# Altium project copper_suicide.PrjPCB (part 1 of 5)
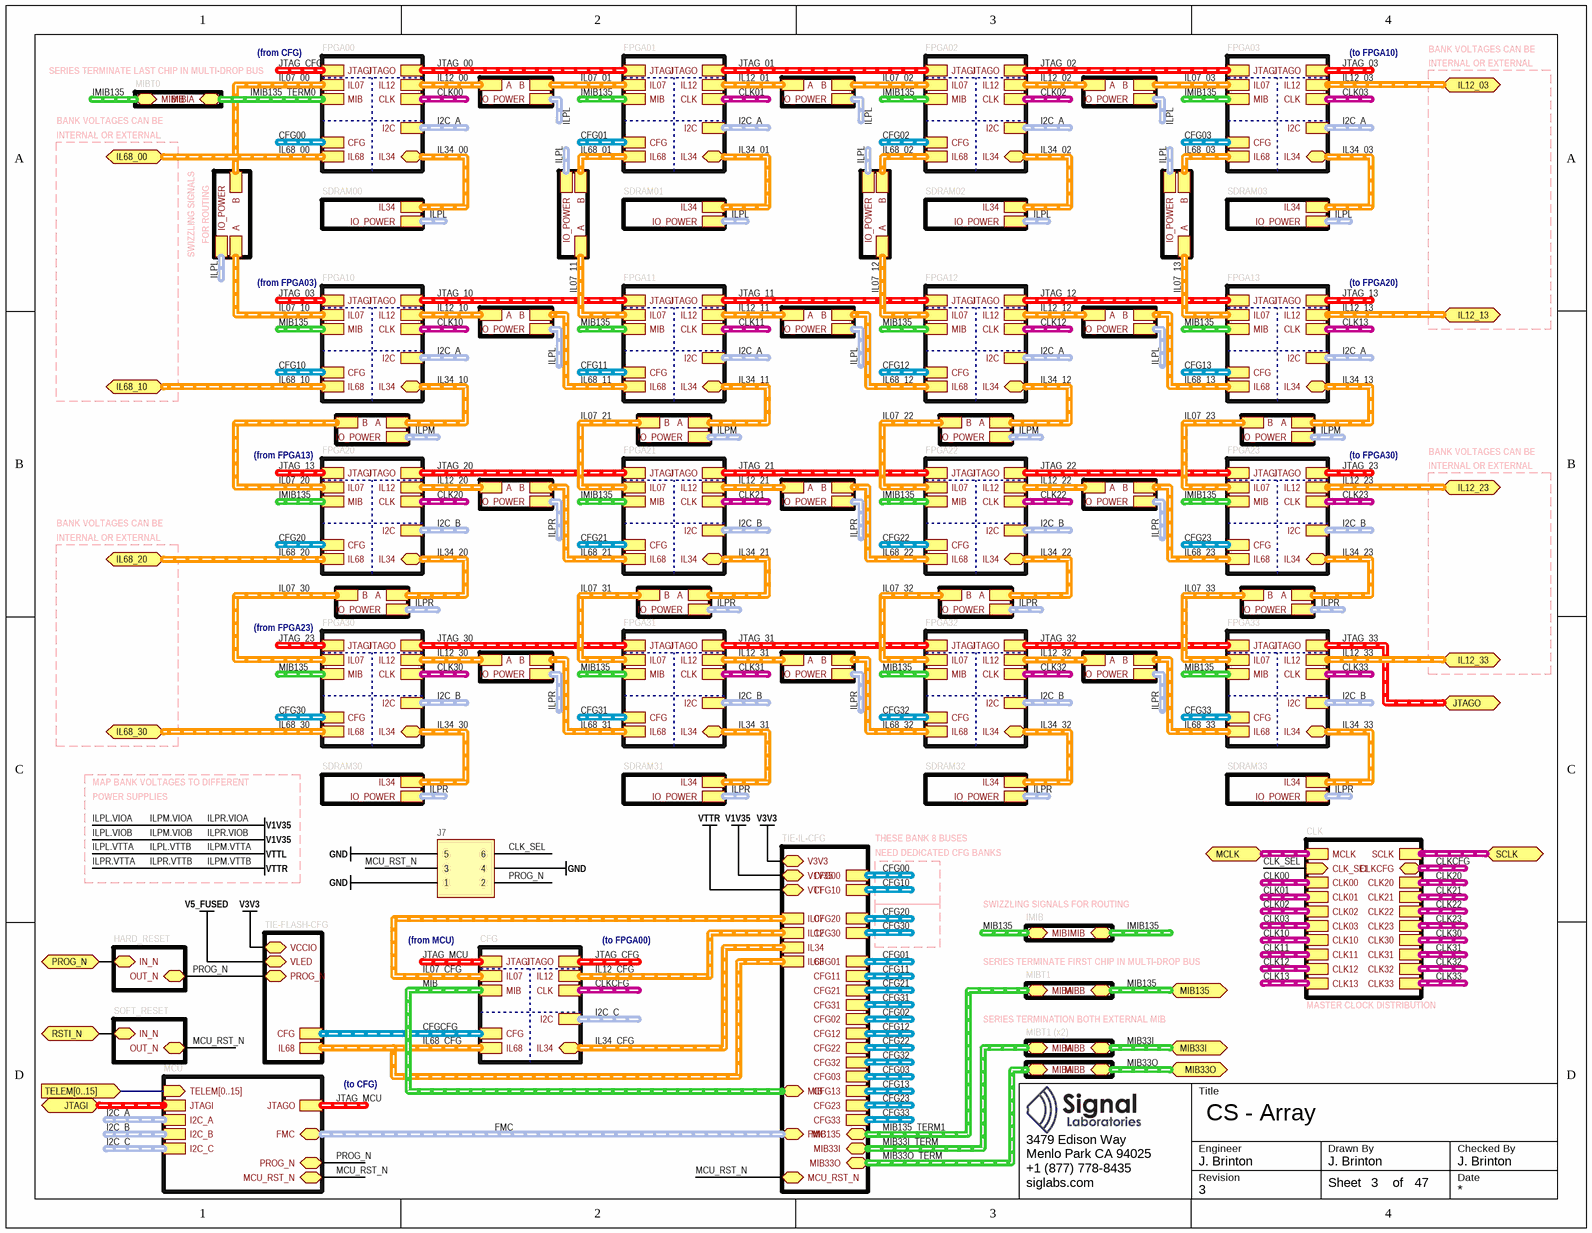
[diagram p0: array.SchDoc]
22 sheets, 1810 parts. Net scope: hierarchical (ports join the sheet entries above them; power ports are global).
Board file: copper_suicide.PcbDoc
Sheets:
  array.SchDoc
    FPGA01 = fpga.SchDoc
      FPGA0B = fpga-bank0.SchDoc
      FPGA1B = fpga-bank1.SchDoc
      FPGA2B = fpga-bank2.SchDoc
      FPGA3B = fpga-bank3.SchDoc
      FPGA4B = fpga-bank4.SchDoc
      FPGA6B = fpga-bank6.SchDoc
      FPGA7B = fpga-bank7.SchDoc
      FPGA8B = fpga-bank8.SchDoc
      FPGAGND = fpga-ground.SchDoc
      FPGAMISC = fpga-misc.SchDoc
      FPGASERDES = fpga-serdes.SchDoc
      FPGAPOWER = fpga-power.SchDoc
    FPGA02 = fpga.SchDoc
      FPGA0B = fpga-bank0.SchDoc
      FPGA1B = fpga-bank1.SchDoc
      FPGA2B = fpga-bank2.SchDoc
      FPGA3B = fpga-bank3.SchDoc
      FPGA4B = fpga-bank4.SchDoc
      FPGA6B = fpga-bank6.SchDoc
      FPGA7B = fpga-bank7.SchDoc
      FPGA8B = fpga-bank8.SchDoc
      FPGAGND = fpga-ground.SchDoc
      FPGAMISC = fpga-misc.SchDoc
      FPGASERDES = fpga-serdes.SchDoc
      FPGAPOWER = fpga-power.SchDoc
    FPGA03 = fpga.SchDoc
      FPGA0B = fpga-bank0.SchDoc
      FPGA1B = fpga-bank1.SchDoc
      FPGA2B = fpga-bank2.SchDoc
      FPGA3B = fpga-bank3.SchDoc
      FPGA4B = fpga-bank4.SchDoc
      FPGA6B = fpga-bank6.SchDoc
      FPGA7B = fpga-bank7.SchDoc
      FPGA8B = fpga-bank8.SchDoc
      FPGAGND = fpga-ground.SchDoc
      FPGAMISC = fpga-misc.SchDoc
      FPGASERDES = fpga-serdes.SchDoc
      FPGAPOWER = fpga-power.SchDoc
    FPGA30 = fpga.SchDoc
      FPGA0B = fpga-bank0.SchDoc
      FPGA1B = fpga-bank1.SchDoc
      FPGA2B = fpga-bank2.SchDoc
      FPGA3B = fpga-bank3.SchDoc
      FPGA4B = fpga-bank4.SchDoc
      FPGA6B = fpga-bank6.SchDoc
      FPGA7B = fpga-bank7.SchDoc
      FPGA8B = fpga-bank8.SchDoc
      FPGAGND = fpga-ground.SchDoc
      FPGAMISC = fpga-misc.SchDoc
      FPGASERDES = fpga-serdes.SchDoc
      FPGAPOWER = fpga-power.SchDoc
    FPGA31 = fpga.SchDoc
      FPGA0B = fpga-bank0.SchDoc
      FPGA1B = fpga-bank1.SchDoc
      FPGA2B = fpga-bank2.SchDoc
      FPGA3B = fpga-bank3.SchDoc
      FPGA4B = fpga-bank4.SchDoc
      FPGA6B = fpga-bank6.SchDoc
      FPGA7B = fpga-bank7.SchDoc
      FPGA8B = fpga-bank8.SchDoc
      FPGAGND = fpga-ground.SchDoc
      FPGAMISC = fpga-misc.SchDoc
      FPGASERDES = fpga-serdes.SchDoc
      FPGAPOWER = fpga-power.SchDoc
    FPGA32 = fpga.SchDoc
      FPGA0B = fpga-bank0.SchDoc
      FPGA1B = fpga-bank1.SchDoc
      FPGA2B = fpga-bank2.SchDoc
      FPGA3B = fpga-bank3.SchDoc
      FPGA4B = fpga-bank4.SchDoc
      FPGA6B = fpga-bank6.SchDoc
      FPGA7B = fpga-bank7.SchDoc
      FPGA8B = fpga-bank8.SchDoc
      FPGAGND = fpga-ground.SchDoc
      FPGAMISC = fpga-misc.SchDoc
      FPGASERDES = fpga-serdes.SchDoc
      FPGAPOWER = fpga-power.SchDoc
    FPGA33 = fpga.SchDoc
      FPGA0B = fpga-bank0.SchDoc
      FPGA1B = fpga-bank1.SchDoc
      FPGA2B = fpga-bank2.SchDoc
      FPGA3B = fpga-bank3.SchDoc
      FPGA4B = fpga-bank4.SchDoc
      FPGA6B = fpga-bank6.SchDoc
      FPGA7B = fpga-bank7.SchDoc
      FPGA8B = fpga-bank8.SchDoc
      FPGAGND = fpga-ground.SchDoc
      FPGAMISC = fpga-misc.SchDoc
      FPGASERDES = fpga-serdes.SchDoc
      FPGAPOWER = fpga-power.SchDoc
    FPGA10 = fpga.SchDoc
      FPGA0B = fpga-bank0.SchDoc
      FPGA1B = fpga-bank1.SchDoc
      FPGA2B = fpga-bank2.SchDoc
      FPGA3B = fpga-bank3.SchDoc
      FPGA4B = fpga-bank4.SchDoc
      FPGA6B = fpga-bank6.SchDoc
      FPGA7B = fpga-bank7.SchDoc
      FPGA8B = fpga-bank8.SchDoc
      FPGAGND = fpga-ground.SchDoc
      FPGAMISC = fpga-misc.SchDoc
      FPGASERDES = fpga-serdes.SchDoc
      FPGAPOWER = fpga-power.SchDoc
    FPGA11 = fpga.SchDoc
      FPGA0B = fpga-bank0.SchDoc
      FPGA1B = fpga-bank1.SchDoc
      FPGA2B = fpga-bank2.SchDoc
      FPGA3B = fpga-bank3.SchDoc
      FPGA4B = fpga-bank4.SchDoc
      FPGA6B = fpga-bank6.SchDoc
      FPGA7B = fpga-bank7.SchDoc
      FPGA8B = fpga-bank8.SchDoc
      FPGAGND = fpga-ground.SchDoc
      FPGAMISC = fpga-misc.SchDoc
      FPGASERDES = fpga-serdes.SchDoc
      FPGAPOWER = fpga-power.SchDoc
    FPGA12 = fpga.SchDoc
      FPGA0B = fpga-bank0.SchDoc
      FPGA1B = fpga-bank1.SchDoc
      FPGA2B = fpga-bank2.SchDoc
      FPGA3B = fpga-bank3.SchDoc
      FPGA4B = fpga-bank4.SchDoc
      FPGA6B = fpga-bank6.SchDoc
      FPGA7B = fpga-bank7.SchDoc
      FPGA8B = fpga-bank8.SchDoc
      FPGAGND = fpga-ground.SchDoc
      FPGAMISC = fpga-misc.SchDoc
      FPGASERDES = fpga-serdes.SchDoc
      FPGAPOWER = fpga-power.SchDoc
    FPGA13 = fpga.SchDoc
      FPGA0B = fpga-bank0.SchDoc
      FPGA1B = fpga-bank1.SchDoc
      FPGA2B = fpga-bank2.SchDoc
      FPGA3B = fpga-bank3.SchDoc
      FPGA4B = fpga-bank4.SchDoc
      FPGA6B = fpga-bank6.SchDoc
      FPGA7B = fpga-bank7.SchDoc
      FPGA8B = fpga-bank8.SchDoc
      FPGAGND = fpga-ground.SchDoc
      FPGAMISC = fpga-misc.SchDoc
      FPGASERDES = fpga-serdes.SchDoc
      FPGAPOWER = fpga-power.SchDoc
    FPGA20 = fpga.SchDoc
      FPGA0B = fpga-bank0.SchDoc
      FPGA1B = fpga-bank1.SchDoc
      FPGA2B = fpga-bank2.SchDoc
      FPGA3B = fpga-bank3.SchDoc
      FPGA4B = fpga-bank4.SchDoc
      FPGA6B = fpga-bank6.SchDoc
      FPGA7B = fpga-bank7.SchDoc
      FPGA8B = fpga-bank8.SchDoc
      FPGAGND = fpga-ground.SchDoc
      FPGAMISC = fpga-misc.SchDoc
      FPGASERDES = fpga-serdes.SchDoc
      FPGAPOWER = fpga-power.SchDoc
    FPGA21 = fpga.SchDoc
      FPGA0B = fpga-bank0.SchDoc
      FPGA1B = fpga-bank1.SchDoc
      FPGA2B = fpga-bank2.SchDoc
      FPGA3B = fpga-bank3.SchDoc
      FPGA4B = fpga-bank4.SchDoc
      FPGA6B = fpga-bank6.SchDoc
      FPGA7B = fpga-bank7.SchDoc
      FPGA8B = fpga-bank8.SchDoc
      FPGAGND = fpga-ground.SchDoc
      FPGAMISC = fpga-misc.SchDoc
      FPGASERDES = fpga-serdes.SchDoc
      FPGAPOWER = fpga-power.SchDoc
    FPGA22 = fpga.SchDoc
      FPGA0B = fpga-bank0.SchDoc
      FPGA1B = fpga-bank1.SchDoc
      FPGA2B = fpga-bank2.SchDoc
      FPGA3B = fpga-bank3.SchDoc
      FPGA4B = fpga-bank4.SchDoc
      FPGA6B = fpga-bank6.SchDoc
      FPGA7B = fpga-bank7.SchDoc
      FPGA8B = fpga-bank8.SchDoc
      FPGAGND = fpga-ground.SchDoc
      FPGAMISC = fpga-misc.SchDoc
      FPGASERDES = fpga-serdes.SchDoc
      FPGAPOWER = fpga-power.SchDoc
    FPGA23 = fpga.SchDoc
      FPGA0B = fpga-bank0.SchDoc
      FPGA1B = fpga-bank1.SchDoc
      FPGA2B = fpga-bank2.SchDoc
      FPGA3B = fpga-bank3.SchDoc
      FPGA4B = fpga-bank4.SchDoc
      FPGA6B = fpga-bank6.SchDoc
      FPGA7B = fpga-bank7.SchDoc
      FPGA8B = fpga-bank8.SchDoc
      FPGAGND = fpga-ground.SchDoc
      FPGAMISC = fpga-misc.SchDoc
      FPGASERDES = fpga-serdes.SchDoc
      FPGAPOWER = fpga-power.SchDoc
    CLK = clock.SchDoc
    CFG = fpga.SchDoc
      FPGA0B = fpga-bank0.SchDoc
      FPGA1B = fpga-bank1.SchDoc
      FPGA2B = fpga-bank2.SchDoc
      FPGA3B = fpga-bank3.SchDoc
      FPGA4B = fpga-bank4.SchDoc
      FPGA6B = fpga-bank6.SchDoc
      FPGA7B = fpga-bank7.SchDoc
      FPGA8B = fpga-bank8.SchDoc
      FPGAGND = fpga-ground.SchDoc
      FPGAMISC = fpga-misc.SchDoc
      FPGASERDES = fpga-serdes.SchDoc
      FPGAPOWER = fpga-power.SchDoc
    FPGA00 = fpga.SchDoc
      FPGA0B = fpga-bank0.SchDoc
      FPGA1B = fpga-bank1.SchDoc
      FPGA2B = fpga-bank2.SchDoc
      FPGA3B = fpga-bank3.SchDoc
      FPGA4B = fpga-bank4.SchDoc
      FPGA6B = fpga-bank6.SchDoc
      FPGA7B = fpga-bank7.SchDoc
      FPGA8B = fpga-bank8.SchDoc
      FPGAGND = fpga-ground.SchDoc
      FPGAMISC = fpga-misc.SchDoc
      FPGASERDES = fpga-serdes.SchDoc
      FPGAPOWER = fpga-power.SchDoc
  con-right-bot.SchDoc
  con-left-bot.SchDoc
  con-right-top.SchDoc
  con-left-top.SchDoc
  config.SchDoc
  flash.SchDoc
  fans.SchDoc

## Sheet array.SchDoc: CS - Array
size Letter; CheckedBy: J. Brinton; CompanyName: Signal Laboratories, Inc.; DrawnBy: J. Brinton; Engineer: J. Brinton; Address1: 3479 Edison Way; Address2: Menlo Park CA 94025; Address3: +1 (877) 778-8435; Address4: siglabs.com; Revision: 3; SheetNumber: 3; SheetTotal: 47

### Parts
J7  GRPB032MWCN-RC  [GRPB032MWCN]  (value not drawn)

### Sub-sheets
CFG = fpga.SchDoc: MIB (harness MIB), CFG (harness CFG), JTAGI (harness JTAG-3V3), JTAGO (harness JTAG-3V3), IL07 (harness IL), IL68 (harness IL), IL12 (harness IL), CLK (harness LVPECL33), IL34 (harness IL), I2C (harness I2C-3V3)
CLK = clock.SchDoc: MCLK (harness LVPECL33), SCLK (harness LVPECL33), CLK00 (harness LVPECL33), CLK01 (harness LVPECL33), CLK02 (harness LVPECL33), CLK03 (harness LVPECL33), CLK10 (harness LVPECL33), CLK11 (harness LVPECL33), CLK12 (harness LVPECL33), CLK13 (harness LVPECL33), CLK20 (harness LVPECL33), CLK21 (harness LVPECL33), CLK22 (harness LVPECL33), CLK23 (harness LVPECL33), CLK30 (harness LVPECL33), CLK31 (harness LVPECL33), CLK32 (harness LVPECL33), CLK33 (harness LVPECL33), CLKCFG (harness LVPECL33), CLK_SEL (in)
FPGA00 = fpga.SchDoc: MIB (harness MIB), CFG (harness CFG), JTAGI (harness JTAG-3V3), JTAGO (harness JTAG-3V3), IL07 (harness IL), IL68 (harness IL), IL12 (harness IL), CLK (harness LVPECL33), IL34 (harness IL), I2C (harness I2C-3V3)
FPGA01 = fpga.SchDoc: MIB (harness MIB), CFG (harness CFG), JTAGI (harness JTAG-3V3), JTAGO (harness JTAG-3V3), IL07 (harness IL), IL68 (harness IL), IL12 (harness IL), CLK (harness LVPECL33), IL34 (harness IL), I2C (harness I2C-3V3)
FPGA02 = fpga.SchDoc: MIB (harness MIB), CFG (harness CFG), JTAGI (harness JTAG-3V3), JTAGO (harness JTAG-3V3), IL07 (harness IL), IL68 (harness IL), IL12 (harness IL), CLK (harness LVPECL33), IL34 (harness IL), I2C (harness I2C-3V3)
FPGA03 = fpga.SchDoc: MIB (harness MIB), CFG (harness CFG), JTAGI (harness JTAG-3V3), JTAGO (harness JTAG-3V3), IL07 (harness IL), IL68 (harness IL), IL12 (harness IL), CLK (harness LVPECL33), IL34 (harness IL), I2C (harness I2C-3V3)
FPGA10 = fpga.SchDoc: MIB (harness MIB), CFG (harness CFG), JTAGI (harness JTAG-3V3), JTAGO (harness JTAG-3V3), IL07 (harness IL), IL68 (harness IL), IL12 (harness IL), CLK (harness LVPECL33), IL34 (harness IL), I2C (harness I2C-3V3)
FPGA11 = fpga.SchDoc: MIB (harness MIB), CFG (harness CFG), JTAGI (harness JTAG-3V3), JTAGO (harness JTAG-3V3), IL07 (harness IL), IL68 (harness IL), IL12 (harness IL), CLK (harness LVPECL33), IL34 (harness IL), I2C (harness I2C-3V3)
FPGA12 = fpga.SchDoc: MIB (harness MIB), CFG (harness CFG), JTAGI (harness JTAG-3V3), JTAGO (harness JTAG-3V3), IL07 (harness IL), IL68 (harness IL), IL12 (harness IL), CLK (harness LVPECL33), IL34 (harness IL), I2C (harness I2C-3V3)
FPGA13 = fpga.SchDoc: MIB (harness MIB), CFG (harness CFG), JTAGI (harness JTAG-3V3), JTAGO (harness JTAG-3V3), IL07 (harness IL), IL68 (harness IL), IL12 (harness IL), CLK (harness LVPECL33), IL34 (harness IL), I2C (harness I2C-3V3)
FPGA20 = fpga.SchDoc: MIB (harness MIB), CFG (harness CFG), JTAGI (harness JTAG-3V3), JTAGO (harness JTAG-3V3), IL07 (harness IL), IL68 (harness IL), IL12 (harness IL), CLK (harness LVPECL33), IL34 (harness IL), I2C (harness I2C-3V3)
FPGA21 = fpga.SchDoc: MIB (harness MIB), CFG (harness CFG), JTAGI (harness JTAG-3V3), JTAGO (harness JTAG-3V3), IL07 (harness IL), IL68 (harness IL), IL12 (harness IL), CLK (harness LVPECL33), IL34 (harness IL), I2C (harness I2C-3V3)
FPGA22 = fpga.SchDoc: MIB (harness MIB), CFG (harness CFG), JTAGI (harness JTAG-3V3), JTAGO (harness JTAG-3V3), IL07 (harness IL), IL68 (harness IL), IL12 (harness IL), CLK (harness LVPECL33), IL34 (harness IL), I2C (harness I2C-3V3)
FPGA23 = fpga.SchDoc: MIB (harness MIB), CFG (harness CFG), JTAGI (harness JTAG-3V3), JTAGO (harness JTAG-3V3), IL07 (harness IL), IL68 (harness IL), IL12 (harness IL), CLK (harness LVPECL33), IL34 (harness IL), I2C (harness I2C-3V3)
FPGA30 = fpga.SchDoc: MIB (harness MIB), CFG (harness CFG), JTAGI (harness JTAG-3V3), JTAGO (harness JTAG-3V3), IL07 (harness IL), IL68 (harness IL), IL12 (harness IL), CLK (harness LVPECL33), IL34 (harness IL), I2C (harness I2C-3V3)
FPGA31 = fpga.SchDoc: MIB (harness MIB), CFG (harness CFG), JTAGI (harness JTAG-3V3), JTAGO (harness JTAG-3V3), IL07 (harness IL), IL68 (harness IL), IL12 (harness IL), CLK (harness LVPECL33), IL34 (harness IL), I2C (harness I2C-3V3)
FPGA32 = fpga.SchDoc: MIB (harness MIB), CFG (harness CFG), JTAGI (harness JTAG-3V3), JTAGO (harness JTAG-3V3), IL07 (harness IL), IL68 (harness IL), IL12 (harness IL), CLK (harness LVPECL33), IL34 (harness IL), I2C (harness I2C-3V3)
FPGA33 = fpga.SchDoc: MIB (harness MIB), CFG (harness CFG), JTAGI (harness JTAG-3V3), JTAGO (harness JTAG-3V3), IL07 (harness IL), IL68 (harness IL), IL12 (harness IL), CLK (harness LVPECL33), IL34 (harness IL), I2C (harness I2C-3V3)
HARD_RESET = reset.SchDoc (file not in this document): OUT_N (bidir), IN_N (bidir)
IMIB = tie-mib-imib.SchDoc (file not in this document): MIB (harness MIB), IMIB (harness MIB)
MCU = MCU.SchDoc (file not in this document): JTAGI (harness JTAG-3V3), JTAGO (harness JTAG-3V3), I2C_A (harness I2C-3V3), I2C_B (harness I2C-3V3), I2C_C (harness I2C-3V3), TELEM[0..15] (in), FMC (harness FMC-3V3), PROG_N (bidir), MCU_RST_N (bidir)
MIBIT1 = tie-mib-term1.SchDoc (file not in this document): MIBB (harness MIB), MIBA (harness MIB)
MIBOT1 = tie-mib-term1.SchDoc (file not in this document): MIBB (harness MIB), MIBA (harness MIB)
MIBT0 = tie-mib-term0.SchDoc (file not in this document): MIBIB (harness MIB), MIBIA (harness MIB)
MIBT1 = tie-mib-term1.SchDoc (file not in this document): MIBB (harness MIB), MIBA (harness MIB)
SDRAM00 = tie-il34-sdram.SchDoc (file not in this document): IL34 (harness IL), IO_POWER (harness ILP)
SDRAM01 = tie-il34-sdram.SchDoc (file not in this document): IL34 (harness IL), IO_POWER (harness ILP)
SDRAM02 = tie-il34-sdram.SchDoc (file not in this document): IL34 (harness IL), IO_POWER (harness ILP)
SDRAM03 = tie-il34-sdram.SchDoc (file not in this document): IL34 (harness IL), IO_POWER (harness ILP)
SDRAM30 = tie-il34-sdram.SchDoc (file not in this document): IL34 (harness IL), IO_POWER (harness ILP)
SDRAM31 = tie-il34-sdram.SchDoc (file not in this document): IL34 (harness IL), IO_POWER (harness ILP)
SDRAM32 = tie-il34-sdram.SchDoc (file not in this document): IL34 (harness IL), IO_POWER (harness ILP)
SDRAM33 = tie-il34-sdram.SchDoc (file not in this document): IL34 (harness IL), IO_POWER (harness ILP)
SOFT_RESET = reset.SchDoc (file not in this document): OUT_N (bidir), IN_N (bidir)
TIE-FLASH-CFG = tie-flash-cfg.SchDoc (file not in this document): CFG (harness CFG), PROG_N (bidir), VCCIO, IL68 (harness IL), VLED
TIE-IL07_00-IL07_10 = tie-il07-il07.SchDoc (file not in this document): B (harness IL), A (harness IL), IO_POWER (harness ILP)
TIE-IL12_00-IL07_01 = tie-il12-il07.SchDoc (file not in this document): A (harness IL), B (harness IL), IO_POWER (harness ILP)
TIE-IL12_01-IL07_02 = tie-il12-il07.SchDoc (file not in this document): A (harness IL), B (harness IL), IO_POWER (harness ILP)
TIE-IL12_02-IL07_03 = tie-il12-il07.SchDoc (file not in this document): A (harness IL), B (harness IL), IO_POWER (harness ILP)
TIE-IL12_10-IL68_11 = tie-il12-il68.SchDoc (file not in this document): A (harness IL), B (harness IL), IO_POWER (harness ILP)
TIE-IL12_11-IL68_12 = tie-il12-il68.SchDoc (file not in this document): A (harness IL), B (harness IL), IO_POWER (harness ILP)
TIE-IL12_12-IL68_13 = tie-il12-il68.SchDoc (file not in this document): A (harness IL), B (harness IL), IO_POWER (harness ILP)
TIE-IL12_20-IL68_21 = tie-il12-il68.SchDoc (file not in this document): A (harness IL), B (harness IL), IO_POWER (harness ILP)
TIE-IL12_21-IL68_22 = tie-il12-il68.SchDoc (file not in this document): A (harness IL), B (harness IL), IO_POWER (harness ILP)
TIE-IL12_22-IL68_23 = tie-il12-il68.SchDoc (file not in this document): A (harness IL), B (harness IL), IO_POWER (harness ILP)
TIE-IL12_30-IL68_31 = tie-il12-il68.SchDoc (file not in this document): A (harness IL), B (harness IL), IO_POWER (harness ILP)
TIE-IL12_31-IL68_32 = tie-il12-il68.SchDoc (file not in this document): A (harness IL), B (harness IL), IO_POWER (harness ILP)
TIE-IL12_32-IL68_33 = tie-il12-il68.SchDoc (file not in this document): A (harness IL), B (harness IL), IO_POWER (harness ILP)
TIE-IL34_10-IL07_20 = tie-il34-il07.SchDoc (file not in this document): B (harness IL), A (harness IL), IO_POWER (harness ILP)
TIE-IL34_11-IL07_21 = tie-il34-il07.SchDoc (file not in this document): B (harness IL), A (harness IL), IO_POWER (harness ILP)
TIE-IL34_12-IL07_22 = tie-il34-il07.SchDoc (file not in this document): B (harness IL), A (harness IL), IO_POWER (harness ILP)
TIE-IL34_13-IL07_23 = tie-il34-il07.SchDoc (file not in this document): B (harness IL), A (harness IL), IO_POWER (harness ILP)
TIE-IL34_20-IL07_30 = tie-il34-il07.SchDoc (file not in this document): B (harness IL), A (harness IL), IO_POWER (harness ILP)
TIE-IL34_21-IL07_31 = tie-il34-il07.SchDoc (file not in this document): B (harness IL), A (harness IL), IO_POWER (harness ILP)
TIE-IL34_22-IL07_32 = tie-il34-il07.SchDoc (file not in this document): B (harness IL), A (harness IL), IO_POWER (harness ILP)
TIE-IL34_23-IL07_33 = tie-il34-il07.SchDoc (file not in this document): B (harness IL), A (harness IL), IO_POWER (harness ILP)
TIE-IL68_00-IL07_01 = tie-il68-il07.SchDoc (file not in this document): B (harness IL), A (harness IL), IO_POWER (harness ILP)
TIE-IL68_00-IL07_01 = tie-il68-il07.SchDoc (file not in this document): B (harness IL), A (harness IL), IO_POWER (harness ILP)
TIE-IL68_00-IL07_01 = tie-il68-il07.SchDoc (file not in this document): B (harness IL), A (harness IL), IO_POWER (harness ILP)
TIE-IL-CFG = tie-il-cfg.SchDoc (file not in this document): CFG03 (harness CFG), CFG02 (harness CFG), CFG01 (harness CFG), CFG00 (harness CFG), MIB33O (harness MIB), CFG13 (harness CFG), CFG12 (harness CFG), CFG11 (harness CFG), CFG10 (harness CFG), CFG23 (harness CFG), CFG22 (harness CFG), CFG21 (harness CFG), CFG20 (harness CFG), CFG33 (harness CFG), CFG32 (harness CFG), CFG31 (harness CFG), CFG30 (harness CFG), IL12 (harness IL), IL34 (harness IL), IL07 (harness IL), MIB135 (harness MIB), IL68 (harness IL), FMC (harness FMC-3V3), MIB33I (harness MIB), MIB (harness MIB), MCU_RST_N (bidir), V3V3, V1V35, VTT

### Ports
IL12_03 (harness IL), IL12_13 (harness IL), IL12_23 (harness IL), IL12_33 (harness IL), IL68_00 (harness IL), IL68_10 (harness IL), IL68_20 (harness IL), IL68_30 (harness IL), JTAGI (harness JTAG-3V3), JTAGO (harness JTAG-3V3), MCLK (harness LVPECL33), MIB33I (harness MIB), MIB33O (harness MIB), MIB135 (harness MIB), PROG_N (bidir), RSTI_N (bidir), SCLK (harness LVPECL33), TELEM[0..15] (in)

### Nets
GND: J7.1 J7.4 J7.5
V3V3: sheet TIE-IL-CFG/V3V3, sheet TIE-FLASH-CFG/VCCIO
V5_FUSED: sheet TIE-FLASH-CFG/VLED
CLK_SEL: J7.6 ; sheet CLK/CLK_SEL
MCU_RST_N: J7.3 ; sheet TIE-IL-CFG/MCU_RST_N, sheet SOFT_RESET/OUT_N, sheet MCU/MCU_RST_N
PROG_N: J7.2 ; sheet TIE-FLASH-CFG/PROG_N, sheet HARD_RESET/OUT_N, sheet MCU/PROG_N
PROG_N: port PROG_N, sheet HARD_RESET/IN_N  [a separate net that carries the same name]
RSTI_N: port RSTI_N, sheet SOFT_RESET/IN_N

### Buses and harness runs
bus port TELEM[0..15] = sheet MCU/TELEM[0..15]
harness CFG00 = sheet FPGA00/CFG
harness CFG00 = sheet TIE-IL-CFG/CFG00
harness CFG01 = sheet FPGA01/CFG
harness CFG01 = sheet TIE-IL-CFG/CFG01
harness CFG02 = sheet FPGA02/CFG
harness CFG02 = sheet TIE-IL-CFG/CFG02
harness CFG03 = sheet FPGA03/CFG
harness CFG03 = sheet TIE-IL-CFG/CFG03
harness CFG10 = sheet FPGA10/CFG
harness CFG10 = sheet TIE-IL-CFG/CFG10
harness CFG11 = sheet FPGA11/CFG
harness CFG11 = sheet TIE-IL-CFG/CFG11
harness CFG12 = sheet FPGA12/CFG
harness CFG12 = sheet TIE-IL-CFG/CFG12
harness CFG13 = sheet FPGA13/CFG
harness CFG13 = sheet TIE-IL-CFG/CFG13
harness CFG20 = sheet FPGA20/CFG
harness CFG20 = sheet TIE-IL-CFG/CFG20
harness CFG21 = sheet FPGA21/CFG
harness CFG21 = sheet TIE-IL-CFG/CFG21
harness CFG22 = sheet FPGA22/CFG
harness CFG22 = sheet TIE-IL-CFG/CFG22
harness CFG23 = sheet FPGA23/CFG
harness CFG23 = sheet TIE-IL-CFG/CFG23
harness CFG30 = sheet FPGA30/CFG
harness CFG30 = sheet TIE-IL-CFG/CFG30
harness CFG31 = sheet FPGA31/CFG
harness CFG31 = sheet TIE-IL-CFG/CFG31
harness CFG32 = sheet FPGA32/CFG
harness CFG32 = sheet TIE-IL-CFG/CFG32
harness CFG33 = sheet FPGA33/CFG
harness CFG33 = sheet TIE-IL-CFG/CFG33
harness CFGCFG = sheet CFG/CFG = sheet TIE-FLASH-CFG/CFG
harness CLK00 = sheet CLK/CLK00
harness CLK00 = sheet FPGA00/CLK
harness CLK01 = sheet CLK/CLK01
harness CLK01 = sheet FPGA01/CLK
harness CLK02 = sheet CLK/CLK02
harness CLK02 = sheet FPGA02/CLK
harness CLK03 = sheet CLK/CLK03
harness CLK03 = sheet FPGA03/CLK
harness CLK10 = sheet CLK/CLK10
harness CLK10 = sheet FPGA10/CLK
harness CLK11 = sheet CLK/CLK11
harness CLK11 = sheet FPGA11/CLK
harness CLK12 = sheet CLK/CLK12
harness CLK12 = sheet FPGA12/CLK
harness CLK13 = sheet CLK/CLK13
harness CLK13 = sheet FPGA13/CLK
harness CLK20 = sheet CLK/CLK20
harness CLK20 = sheet FPGA20/CLK
harness CLK21 = sheet CLK/CLK21
harness CLK21 = sheet FPGA21/CLK
harness CLK22 = sheet CLK/CLK22
harness CLK22 = sheet FPGA22/CLK
harness CLK23 = sheet CLK/CLK23
harness CLK23 = sheet FPGA23/CLK
harness CLK30 = sheet CLK/CLK30
harness CLK30 = sheet FPGA30/CLK
harness CLK31 = sheet CLK/CLK31
harness CLK31 = sheet FPGA31/CLK
harness CLK32 = sheet CLK/CLK32
harness CLK32 = sheet FPGA32/CLK
harness CLK33 = sheet CLK/CLK33
harness CLK33 = sheet FPGA33/CLK
harness CLKCFG = sheet CFG/CLK
harness CLKCFG = sheet CLK/CLKCFG
harness FMC = sheet MCU/FMC = sheet TIE-IL-CFG/FMC
harness I2C_A = sheet FPGA00/I2C
harness I2C_A = sheet FPGA01/I2C
harness I2C_A = sheet FPGA02/I2C
harness I2C_A = sheet FPGA03/I2C
harness I2C_A = sheet FPGA10/I2C
harness I2C_A = sheet FPGA11/I2C
harness I2C_A = sheet FPGA12/I2C
harness I2C_A = sheet FPGA13/I2C
harness I2C_A = sheet MCU/I2C_A
harness I2C_B = sheet FPGA20/I2C
harness I2C_B = sheet FPGA21/I2C
harness I2C_B = sheet FPGA22/I2C
harness I2C_B = sheet FPGA23/I2C
harness I2C_B = sheet FPGA30/I2C
harness I2C_B = sheet FPGA31/I2C
harness I2C_B = sheet FPGA32/I2C
harness I2C_B = sheet FPGA33/I2C
harness I2C_B = sheet MCU/I2C_B
harness I2C_C = sheet CFG/I2C
harness I2C_C = sheet MCU/I2C_C
harness IL07_00 = sheet FPGA00/IL07 = sheet TIE-IL07_00-IL07_10/B
harness IL07_01 = sheet FPGA01/IL07 = sheet TIE-IL12_00-IL07_01/B
harness IL07_02 = sheet FPGA02/IL07 = sheet TIE-IL12_01-IL07_02/B
harness IL07_03 = sheet FPGA03/IL07 = sheet TIE-IL12_02-IL07_03/B
harness IL07_10 = sheet FPGA10/IL07 = sheet TIE-IL07_00-IL07_10/A
harness IL07_11 = sheet FPGA11/IL07 = sheet TIE-IL68_00-IL07_01/A
harness IL07_12 = sheet FPGA12/IL07 = sheet TIE-IL68_00-IL07_01/A
harness IL07_13 = sheet FPGA13/IL07 = sheet TIE-IL68_00-IL07_01/A
harness IL07_20 = sheet FPGA20/IL07 = sheet TIE-IL34_10-IL07_20/B
harness IL07_21 = sheet FPGA21/IL07 = sheet TIE-IL34_11-IL07_21/B
harness IL07_22 = sheet FPGA22/IL07 = sheet TIE-IL34_12-IL07_22/B
harness IL07_23 = sheet FPGA23/IL07 = sheet TIE-IL34_13-IL07_23/B
harness IL07_30 = sheet FPGA30/IL07 = sheet TIE-IL34_20-IL07_30/B
harness IL07_31 = sheet FPGA31/IL07 = sheet TIE-IL34_21-IL07_31/B
harness IL07_32 = sheet FPGA32/IL07 = sheet TIE-IL34_22-IL07_32/B
harness IL07_33 = sheet FPGA33/IL07 = sheet TIE-IL34_23-IL07_33/B
harness IL07_CFG = sheet CFG/IL07 = sheet TIE-IL-CFG/IL07
harness IL12_00 = sheet FPGA00/IL12 = sheet TIE-IL12_00-IL07_01/A
harness IL12_01 = sheet FPGA01/IL12 = sheet TIE-IL12_01-IL07_02/A
harness IL12_02 = sheet FPGA02/IL12 = sheet TIE-IL12_02-IL07_03/A
harness IL12_03 = port IL12_03 = sheet FPGA03/IL12
harness IL12_10 = sheet FPGA10/IL12 = sheet TIE-IL12_10-IL68_11/A
harness IL12_11 = sheet FPGA11/IL12 = sheet TIE-IL12_11-IL68_12/A
harness IL12_12 = sheet FPGA12/IL12 = sheet TIE-IL12_12-IL68_13/A
harness IL12_13 = port IL12_13 = sheet FPGA13/IL12
harness IL12_20 = sheet FPGA20/IL12 = sheet TIE-IL12_20-IL68_21/A
harness IL12_21 = sheet FPGA21/IL12 = sheet TIE-IL12_21-IL68_22/A
harness IL12_22 = sheet FPGA22/IL12 = sheet TIE-IL12_22-IL68_23/A
harness IL12_23 = port IL12_23 = sheet FPGA23/IL12
harness IL12_30 = sheet FPGA30/IL12 = sheet TIE-IL12_30-IL68_31/A
harness IL12_31 = sheet FPGA31/IL12 = sheet TIE-IL12_31-IL68_32/A
harness IL12_32 = sheet FPGA32/IL12 = sheet TIE-IL12_32-IL68_33/A
harness IL12_33 = port IL12_33 = sheet FPGA33/IL12
harness IL12_CFG = sheet CFG/IL12 = sheet TIE-IL-CFG/IL12
harness IL34_00 = sheet FPGA00/IL34 = sheet SDRAM00/IL34
harness IL34_01 = sheet FPGA01/IL34 = sheet SDRAM01/IL34
harness IL34_02 = sheet FPGA02/IL34 = sheet SDRAM02/IL34
harness IL34_03 = sheet FPGA03/IL34 = sheet SDRAM03/IL34
harness IL34_10 = sheet FPGA10/IL34 = sheet TIE-IL34_10-IL07_20/A
harness IL34_11 = sheet FPGA11/IL34 = sheet TIE-IL34_11-IL07_21/A
harness IL34_12 = sheet FPGA12/IL34 = sheet TIE-IL34_12-IL07_22/A
harness IL34_13 = sheet FPGA13/IL34 = sheet TIE-IL34_13-IL07_23/A
harness IL34_20 = sheet FPGA20/IL34 = sheet TIE-IL34_20-IL07_30/A
harness IL34_21 = sheet FPGA21/IL34 = sheet TIE-IL34_21-IL07_31/A
harness IL34_22 = sheet FPGA22/IL34 = sheet TIE-IL34_22-IL07_32/A
harness IL34_23 = sheet FPGA23/IL34 = sheet TIE-IL34_23-IL07_33/A
harness IL34_30 = sheet FPGA30/IL34 = sheet SDRAM30/IL34
harness IL34_31 = sheet FPGA31/IL34 = sheet SDRAM31/IL34
harness IL34_32 = sheet FPGA32/IL34 = sheet SDRAM32/IL34
harness IL34_33 = sheet FPGA33/IL34 = sheet SDRAM33/IL34
harness IL34_CFG = sheet CFG/IL34 = sheet TIE-IL-CFG/IL34
harness IL68_00 = port IL68_00 = sheet FPGA00/IL68
harness IL68_01 = sheet FPGA01/IL68 = sheet TIE-IL68_00-IL07_01/B
harness IL68_02 = sheet FPGA02/IL68 = sheet TIE-IL68_00-IL07_01/B
harness IL68_03 = sheet FPGA03/IL68 = sheet TIE-IL68_00-IL07_01/B
harness IL68_10 = port IL68_10 = sheet FPGA10/IL68
harness IL68_11 = sheet FPGA11/IL68 = sheet TIE-IL12_10-IL68_11/B
harness IL68_12 = sheet FPGA12/IL68 = sheet TIE-IL12_11-IL68_12/B
harness IL68_13 = sheet FPGA13/IL68 = sheet TIE-IL12_12-IL68_13/B
harness IL68_20 = port IL68_20 = sheet FPGA20/IL68
harness IL68_21 = sheet FPGA21/IL68 = sheet TIE-IL12_20-IL68_21/B
harness IL68_22 = sheet FPGA22/IL68 = sheet TIE-IL12_21-IL68_22/B
harness IL68_23 = sheet FPGA23/IL68 = sheet TIE-IL12_22-IL68_23/B
harness IL68_30 = port IL68_30 = sheet FPGA30/IL68
harness IL68_31 = sheet FPGA31/IL68 = sheet TIE-IL12_30-IL68_31/B
harness IL68_32 = sheet FPGA32/IL68 = sheet TIE-IL12_31-IL68_32/B
harness IL68_33 = sheet FPGA33/IL68 = sheet TIE-IL12_32-IL68_33/B
harness IL68_CFG = sheet CFG/IL68 = sheet TIE-FLASH-CFG/IL68 = sheet TIE-IL-CFG/IL68
harness ILPL = sheet SDRAM00/IO_POWER
harness ILPL = sheet SDRAM01/IO_POWER
harness ILPL = sheet SDRAM02/IO_POWER
harness ILPL = sheet SDRAM03/IO_POWER
harness ILPL = sheet TIE-IL07_00-IL07_10/IO_POWER
harness ILPL = sheet TIE-IL12_00-IL07_01/IO_POWER
harness ILPL = sheet TIE-IL12_01-IL07_02/IO_POWER
harness ILPL = sheet TIE-IL12_02-IL07_03/IO_POWER
harness ILPL = sheet TIE-IL12_10-IL68_11/IO_POWER
harness ILPL = sheet TIE-IL12_11-IL68_12/IO_POWER
harness ILPL = sheet TIE-IL12_12-IL68_13/IO_POWER
harness ILPL = sheet TIE-IL68_00-IL07_01/IO_POWER
harness ILPM = sheet TIE-IL34_10-IL07_20/IO_POWER
harness ILPM = sheet TIE-IL34_11-IL07_21/IO_POWER
harness ILPM = sheet TIE-IL34_12-IL07_22/IO_POWER
harness ILPM = sheet TIE-IL34_13-IL07_23/IO_POWER
harness ILPR = sheet SDRAM30/IO_POWER
harness ILPR = sheet SDRAM31/IO_POWER
harness ILPR = sheet SDRAM32/IO_POWER
harness ILPR = sheet SDRAM33/IO_POWER
harness ILPR = sheet TIE-IL12_20-IL68_21/IO_POWER
harness ILPR = sheet TIE-IL12_21-IL68_22/IO_POWER
harness ILPR = sheet TIE-IL12_22-IL68_23/IO_POWER
harness ILPR = sheet TIE-IL12_30-IL68_31/IO_POWER
harness ILPR = sheet TIE-IL12_31-IL68_32/IO_POWER
harness ILPR = sheet TIE-IL12_32-IL68_33/IO_POWER
harness ILPR = sheet TIE-IL34_20-IL07_30/IO_POWER
harness ILPR = sheet TIE-IL34_21-IL07_31/IO_POWER
harness ILPR = sheet TIE-IL34_22-IL07_32/IO_POWER
harness ILPR = sheet TIE-IL34_23-IL07_33/IO_POWER
harness IMIB135 = sheet FPGA01/MIB
harness IMIB135 = sheet FPGA02/MIB
harness IMIB135 = sheet FPGA03/MIB
harness IMIB135 = sheet FPGA20/MIB
harness IMIB135 = sheet FPGA21/MIB
harness IMIB135 = sheet FPGA22/MIB
harness IMIB135 = sheet FPGA23/MIB
harness IMIB135 = sheet IMIB/IMIB
harness IMIB135 = sheet MIBT0/MIBIB
harness IMIB135_TERM0 = sheet FPGA00/MIB = sheet MIBT0/MIBIA
harness JTAG_00 = sheet FPGA00/JTAGO = sheet FPGA01/JTAGI
harness JTAG_01 = sheet FPGA01/JTAGO = sheet FPGA02/JTAGI
harness JTAG_02 = sheet FPGA02/JTAGO = sheet FPGA03/JTAGI
harness JTAG_03 = sheet FPGA03/JTAGO
harness JTAG_03 = sheet FPGA10/JTAGI
harness JTAG_10 = sheet FPGA10/JTAGO = sheet FPGA11/JTAGI
harness JTAG_11 = sheet FPGA11/JTAGO = sheet FPGA12/JTAGI
harness JTAG_12 = sheet FPGA12/JTAGO = sheet FPGA13/JTAGI
harness JTAG_13 = sheet FPGA13/JTAGO
harness JTAG_13 = sheet FPGA20/JTAGI
harness JTAG_20 = sheet FPGA20/JTAGO = sheet FPGA21/JTAGI
harness JTAG_21 = sheet FPGA21/JTAGO = sheet FPGA22/JTAGI
harness JTAG_22 = sheet FPGA22/JTAGO = sheet FPGA23/JTAGI
harness JTAG_23 = sheet FPGA23/JTAGO
harness JTAG_23 = sheet FPGA30/JTAGI
harness JTAG_30 = sheet FPGA30/JTAGO = sheet FPGA31/JTAGI
harness JTAG_31 = sheet FPGA31/JTAGO = sheet FPGA32/JTAGI
harness JTAG_32 = sheet FPGA32/JTAGO = sheet FPGA33/JTAGI
harness JTAG_33 = port JTAGO = sheet FPGA33/JTAGO
harness JTAG_CFG = sheet CFG/JTAGO
harness JTAG_CFG = sheet FPGA00/JTAGI
harness JTAG_MCU = sheet CFG/JTAGI
harness JTAG_MCU = sheet MCU/JTAGO
harness MIB33I = port MIB33I = sheet MIBIT1/MIBB
harness MIB33I_TERM = sheet MIBIT1/MIBA = sheet TIE-IL-CFG/MIB33I
harness MIB33O = port MIB33O = sheet MIBOT1/MIBB
harness MIB33O_TERM = sheet MIBOT1/MIBA = sheet TIE-IL-CFG/MIB33O
harness MIB135 = port MIB135 = sheet MIBT1/MIBB
harness MIB135 = sheet FPGA10/MIB
harness MIB135 = sheet FPGA11/MIB
harness MIB135 = sheet FPGA12/MIB
harness MIB135 = sheet FPGA13/MIB
harness MIB135 = sheet FPGA30/MIB
harness MIB135 = sheet FPGA31/MIB
harness MIB135 = sheet FPGA32/MIB
harness MIB135 = sheet FPGA33/MIB
harness MIB135 = sheet IMIB/MIB
harness MIB135_TERM1 = sheet MIBT1/MIBA = sheet TIE-IL-CFG/MIB135
harness MIB = sheet CFG/MIB = sheet TIE-IL-CFG/MIB
harness port JTAGI = sheet MCU/JTAGI
harness port MCLK = sheet CLK/MCLK
harness port SCLK = sheet CLK/SCLK

### Notes on the sheet
- SERIES TERMINATE LAST CHIP IN MULTI-DROP BUS
- (from CFG)
- (to FPGA10)
- BANK VOLTAGES CAN BE
- INTERNAL OR EXTERNAL
- SWIZZLING SIGNALS
- FOR ROUTING
- (from FPGA03)
- (to FPGA20)
- (from FPGA13)
- (to FPGA30)
- (from FPGA23)
- POWER SUPPLIES
- MAP BANK VOLTAGES TO DIFFERENT
- THESE BANK 8 BUSES
- NEED DEDICATED CFG BANKS
- (near J7) (from MCU)
- (to FPGA00)
- SWIZZLING SIGNALS FOR ROUTING
- SERIES TERMINATE FIRST CHIP IN MULTI-DROP BUS
- SERIES TERMINATION BOTH EXTERNAL MIB
- MIBT1 (x2)
- MIBT1
- MASTER CLOCK DISTRIBUTION
- (to CFG)
- Title
- Engineer
- Revision
- Drawn By
- Checked By
- Date
- Sheet
- of

### Library data of the parts
J7 = GRPB032MWCN-RC: Male Header, 0.050" Pitch, Right Angle, 2x3 Position; Manufacturer: Sullins; Manufacturer P/N: GRPB032MWCN-RC

## Sheet fpga.SchDoc: CS - FPGA
size Letter; CheckedBy: J. Brinton; CompanyName: Signal Laboratories, Inc.; DrawnBy: J. Brinton; Engineer: J. Brinton; Address1: 3479 Edison Way; Address2: Menlo Park CA 94025; Address3: +1 (877) 778-8435; Address4: siglabs.com; Revision: 3; SheetNumber: 4; SheetTotal: 47
Used 17 times, as channels FPGA01, FPGA02, FPGA03, FPGA30, FPGA31, FPGA32, FPGA33, FPGA10, FPGA11, FPGA12, FPGA13, FPGA20, FPGA21, FPGA22, FPGA23, CFG, FPGA00. Parts and nets are listed once, with the designators drawn on the sheet.
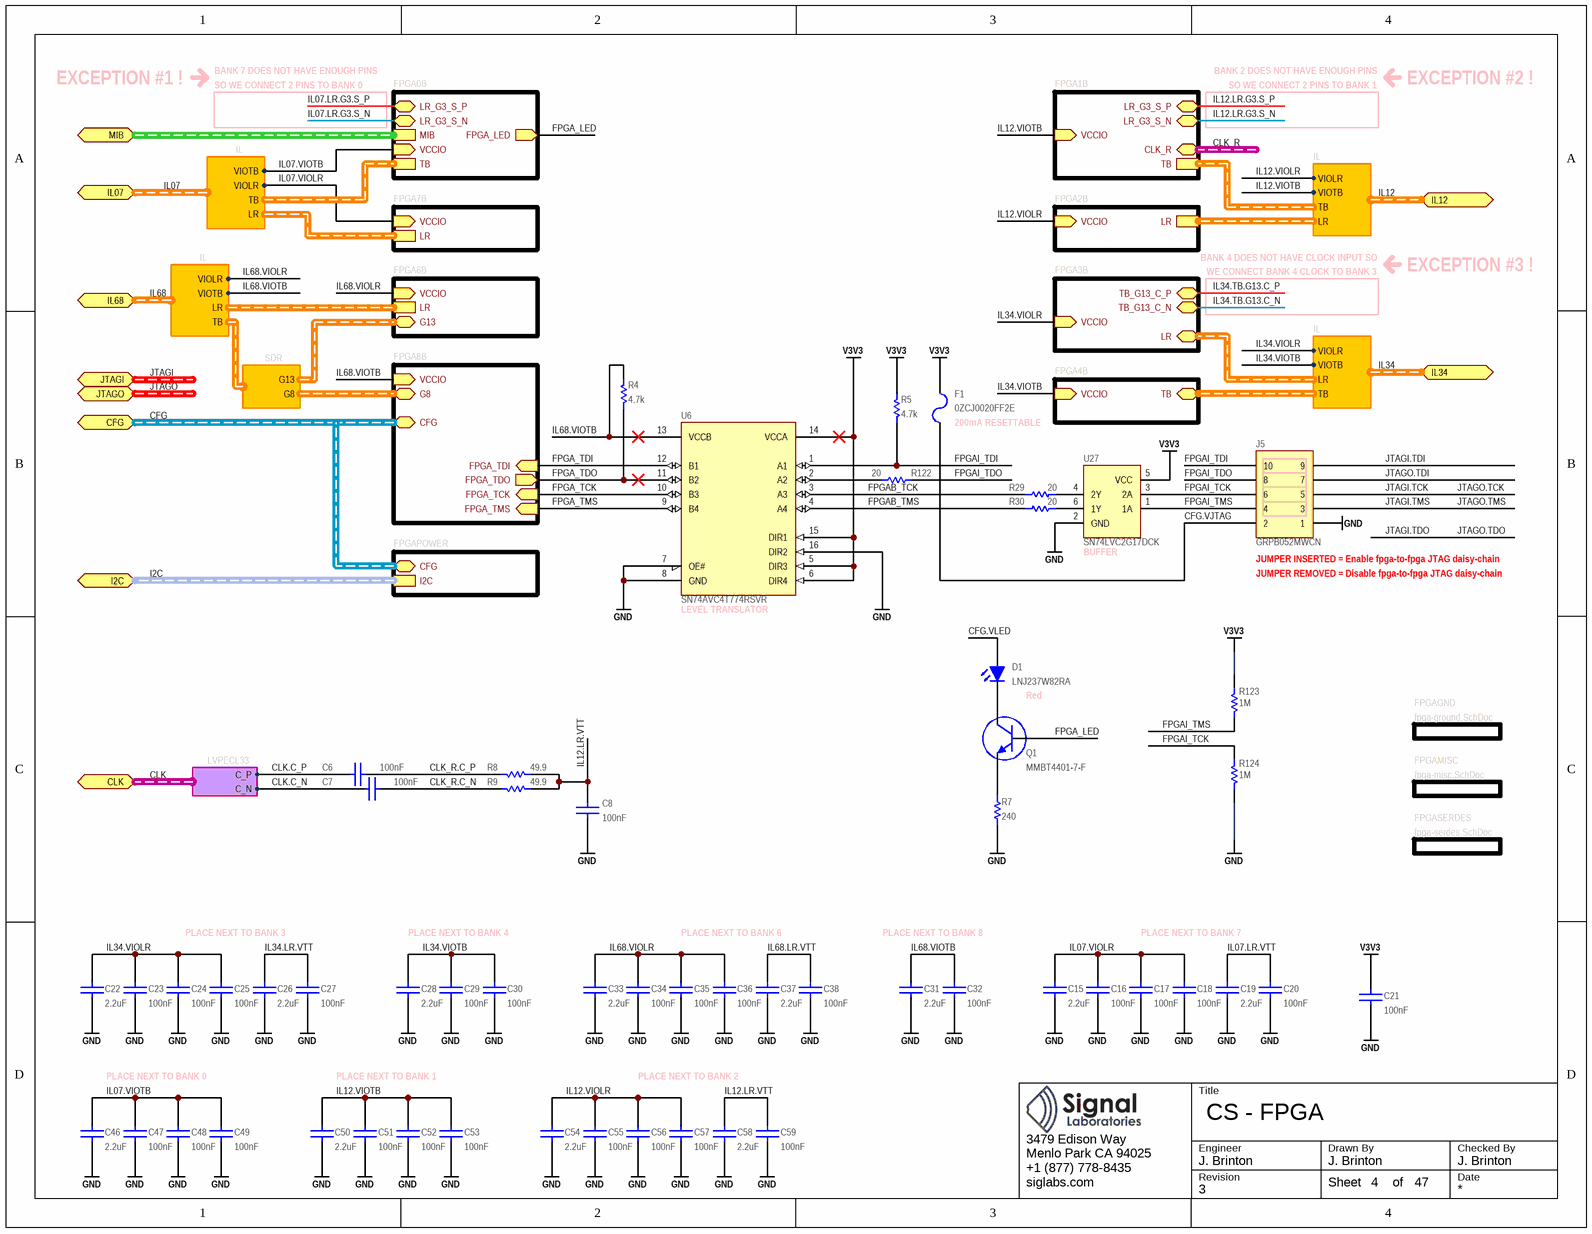
[diagram p1: fpga.SchDoc]

### Parts
C6  value 100nF  [CAPC100X50X55L25N]  (hidden comment: GCM155R71H104KE02)
C7  value 100nF  [CAPC100X50X55L25N]  (hidden comment: GCM155R71H104KE02)
C8  value 100nF  [CAPC100X50X55L25N]  (hidden comment: GCM155R71H104KE02)
C15  value 2.2uF  [CAPC160X80X90L20N]  (hidden comment: C1608X7R1A225M080)
C16  value 100nF  [CAPC100X50X55L25N]  (hidden comment: GCM155R71H104KE02)
C17  value 100nF  [CAPC100X50X55L25N]  (hidden comment: GCM155R71H104KE02)
C18  value 100nF  [CAPC100X50X55L25N]  (hidden comment: GCM155R71H104KE02)
C19  value 2.2uF  [CAPC160X80X90L20N]  (hidden comment: C1608X7R1A225M080)
C20  value 100nF  [CAPC100X50X55L25N]  (hidden comment: GCM155R71H104KE02)
C21  value 100nF  [CAPC100X50X55L25N]  (hidden comment: GCM155R71H104KE02)
C22  value 2.2uF  [CAPC160X80X90L20N]  (hidden comment: C1608X7R1A225M080)
C23  value 100nF  [CAPC100X50X55L25N]  (hidden comment: GCM155R71H104KE02)
C24  value 100nF  [CAPC100X50X55L25N]  (hidden comment: GCM155R71H104KE02)
C25  value 100nF  [CAPC100X50X55L25N]  (hidden comment: GCM155R71H104KE02)
C26  value 2.2uF  [CAPC160X80X90L20N]  (hidden comment: C1608X7R1A225M080)
C27  value 100nF  [CAPC100X50X55L25N]  (hidden comment: GCM155R71H104KE02)
C28  value 2.2uF  [CAPC160X80X90L20N]  (hidden comment: C1608X7R1A225M080)
C29  value 100nF  [CAPC100X50X55L25N]  (hidden comment: GCM155R71H104KE02)
C30  value 100nF  [CAPC100X50X55L25N]  (hidden comment: GCM155R71H104KE02)
C31  value 2.2uF  [CAPC160X80X90L20N]  (hidden comment: C1608X7R1A225M080)
C32  value 100nF  [CAPC100X50X55L25N]  (hidden comment: GCM155R71H104KE02)
C33  value 2.2uF  [CAPC160X80X90L20N]  (hidden comment: C1608X7R1A225M080)
C34  value 100nF  [CAPC100X50X55L25N]  (hidden comment: GCM155R71H104KE02)
C35  value 100nF  [CAPC100X50X55L25N]  (hidden comment: GCM155R71H104KE02)
C36  value 100nF  [CAPC100X50X55L25N]  (hidden comment: GCM155R71H104KE02)
C37  value 2.2uF  [CAPC160X80X90L20N]  (hidden comment: C1608X7R1A225M080)
C38  value 100nF  [CAPC100X50X55L25N]  (hidden comment: GCM155R71H104KE02)
C46  value 2.2uF  [CAPC160X80X90L20N]  (hidden comment: C1608X7R1A225M080)
C47  value 100nF  [CAPC100X50X55L25N]  (hidden comment: GCM155R71H104KE02)
C48  value 100nF  [CAPC100X50X55L25N]  (hidden comment: GCM155R71H104KE02)
C49  value 100nF  [CAPC100X50X55L25N]  (hidden comment: GCM155R71H104KE02)
C50  value 2.2uF  [CAPC160X80X90L20N]  (hidden comment: C1608X7R1A225M080)
C51  value 100nF  [CAPC100X50X55L25N]  (hidden comment: GCM155R71H104KE02)
C52  value 100nF  [CAPC100X50X55L25N]  (hidden comment: GCM155R71H104KE02)
C53  value 100nF  [CAPC100X50X55L25N]  (hidden comment: GCM155R71H104KE02)
C54  value 2.2uF  [CAPC160X80X90L20N]  (hidden comment: C1608X7R1A225M080)
C55  value 100nF  [CAPC100X50X55L25N]  (hidden comment: GCM155R71H104KE02)
C56  value 100nF  [CAPC100X50X55L25N]  (hidden comment: GCM155R71H104KE02)
C57  value 100nF  [CAPC100X50X55L25N]  (hidden comment: GCM155R71H104KE02)
C58  value 2.2uF  [CAPC160X80X90L20N]  (hidden comment: C1608X7R1A225M080)
C59  value 100nF  [CAPC100X50X55L25N]  (hidden comment: GCM155R71H104KE02)
D1  LNJ237W82RA  [0603_LED]
F1  0ZCJ0020FF2E  [1206]
J5  GRPB052MWCN  [GRPB052MWCN]
Q1  MMBT4401-7-F  [SOT23]
R4  value 4.7k  [RESC1005X40N]  (hidden comment: ERJ-2RKF4701X)
R5  value 4.7k  [RESC1005X40N]  (hidden comment: ERJ-2RKF4701X)
R7  value 240  [RESC1005X40N]  (hidden comment: ERJ-2RKF2400X)
R8  value 49.9  [RESC1005X40N]  (hidden comment: ERJ-2RKF49R9X)
R9  value 49.9  [RESC1005X40N]  (hidden comment: ERJ-2RKF49R9X)
R29  value 20  [RESC1005X40N]  (hidden comment: ERJ-2RKF20R0X)
R30  value 20  [RESC1005X40N]  (hidden comment: ERJ-2RKF20R0X)
R122  value 20  [RESC1005X40N]  (hidden comment: ERJ-2RKF20R0X)
R123  value 1M  [RESC1005X40N]  (hidden comment: ERJ-2RKF1004X)
R124  value 1M  [RESC1005X40N]  (hidden comment: ERJ-2RKF1004X)
U6  SN74AVC4T774RSVR  [RSV]
U27  SN74LVC2G17DCK  [DCK-6]

### Sub-sheets
FPGA0B = fpga-bank0.SchDoc: MIB (harness MIB), TB (harness SDR), VCCIO (in), FPGA_LED (out), LR_G3_S_N, LR_G3_S_P
FPGA1B = fpga-bank1.SchDoc: TB (harness SDR), VCCIO (in), CLK_R (harness LVPECL33), LR_G3_S_N, LR_G3_S_P
FPGA2B = fpga-bank2.SchDoc: LR (harness DDR), VCCIO (in)
FPGA3B = fpga-bank3.SchDoc: LR (harness DDR), TB_G13_C_P, TB_G13_C_N, VCCIO (in)
FPGA4B = fpga-bank4.SchDoc: TB (harness SDR), VCCIO (in)
FPGA6B = fpga-bank6.SchDoc: LR (harness DDR), G13 (harness GPIO13), VCCIO (in)
FPGA7B = fpga-bank7.SchDoc: LR (harness DDR), VCCIO (in)
FPGA8B = fpga-bank8.SchDoc: G8 (harness GPIO8), CFG (harness CFG), FPGA_TDO (out), FPGA_TDI (in), FPGA_TMS (in), FPGA_TCK (in), VCCIO (in)
FPGAGND = fpga-ground.SchDoc: no entries
FPGAMISC = fpga-misc.SchDoc: no entries
FPGAPOWER = fpga-power.SchDoc: CFG (harness CFG), I2C (harness I2C-3V3)
FPGASERDES = fpga-serdes.SchDoc: no entries

### Ports
CFG (harness CFG), CLK (harness LVPECL33), I2C (harness I2C-3V3), IL07 (harness IL), IL12 (harness IL), IL34 (harness IL), IL68 (harness IL), JTAGI (harness JTAG-3V3), JTAGO (harness JTAG-3V3), MIB (harness MIB)

### Harnesses
IL: LR, TB, VIOLR, VIOTB
SDR: G13, G8
IL: TB, LR, VIOLR, VIOTB
LVPECL33: C_P, C_N

### Nets
GND: C8.1 C15.1 C16.1 C17.1 C18.1 C19.1 C20.1 C21.1 C22.1 C23.1 C24.1 C25.1 C26.1 C27.1 C28.1 C29.1 C30.1 C31.1 C32.1 C33.1 C34.1 C35.1 C36.1 C37.1 C38.1 C46.1 C47.1 C48.1 C49.1 C50.1 C51.1 C52.1 C53.1 C54.1 C55.1 C56.1 C57.1 C58.1 C59.1 J5.1 R7.2 R124.2 U6.7(OE#) U6.8(GND) U6.16(DIR2) U27.2(GND)
V3V3: C21.2 F1.1 R5.2 R123.1 U6.5(DIR3) U6.6(DIR4) U6.14(VCCA) U6.15(DIR1) U27.5(VCC)
CFG.VJTAG: F1.2 J5.2
CFG.VLED: D1.1(A)
CLK.C_N: C7.2 ; port CLK.C_N
CLK.C_P: C6.2 ; port CLK.C_P
CLK_R.C_N: C7.1 R9.2
CLK_R.C_P: C6.1 R8.2
FPGA_LED: Q1.1(B) ; sheet FPGA0B/FPGA_LED
FPGA_TCK: U6.10(B3) ; sheet FPGA8B/FPGA_TCK
FPGA_TDI: U6.12(B1) ; sheet FPGA8B/FPGA_TDI
FPGA_TDO: R4.1 U6.11(B2) ; sheet FPGA8B/FPGA_TDO
FPGA_TMS: U6.9(B4) ; sheet FPGA8B/FPGA_TMS
FPGAB_TCK: R29.1 U6.3(A3)
FPGAB_TMS: R30.1 U6.4(A4)
FPGAI_TCK: J5.6 R124.1 U27.3(2A)
FPGAI_TDI: J5.10 R5.1 U6.1(A1)
FPGAI_TDO: J5.8 R122.2
FPGAI_TMS: J5.4 R123.2 U27.1(1A)
IL07.LR.G3.S_N: sheet FPGA0B/LR_G3_S_N
IL07.LR.G3.S_P: sheet FPGA0B/LR_G3_S_P
IL07.LR.VTT: C19.2 C20.2
IL07.VIOLR: C15.2 C16.2 C17.2 C18.2 ; sheet FPGA7B/VCCIO, port IL07.VIOLR
IL07.VIOTB: C46.2 C47.2 C48.2 C49.2 ; sheet FPGA0B/VCCIO, port IL07.VIOTB
IL12.LR.G3.S_N: sheet FPGA1B/LR_G3_S_N
IL12.LR.G3.S_P: sheet FPGA1B/LR_G3_S_P
IL12.LR.VTT: C8.2 C58.2 C59.2 R8.1 R9.1
IL12.VIOLR: C54.2 C55.2 C56.2 C57.2 ; sheet FPGA2B/VCCIO, port IL12.VIOLR
IL12.VIOTB: C50.2 C51.2 C52.2 C53.2 ; sheet FPGA1B/VCCIO, port IL12.VIOTB
IL34.LR.VTT: C26.2 C27.2
IL34.TB.G13.C_N: sheet FPGA3B/TB_G13_C_N
IL34.TB.G13.C_P: sheet FPGA3B/TB_G13_C_P
IL34.VIOLR: C22.2 C23.2 C24.2 C25.2 ; sheet FPGA3B/VCCIO, port IL34.VIOLR
IL34.VIOTB: C28.2 C29.2 C30.2 ; sheet FPGA4B/VCCIO, port IL34.VIOTB
IL68.LR.VTT: C37.2 C38.2
IL68.VIOLR: C33.2 C34.2 C35.2 C36.2 ; sheet FPGA6B/VCCIO, port IL68.VIOLR
IL68.VIOTB: C31.2 C32.2 R4.2 U6.13(VCCB) ; sheet FPGA8B/VCCIO, port IL68.VIOTB
JTAGI.TCK: J5.5  [also labelled JTAGO.TCK]
JTAGI.TDI: J5.9
JTAGI.TMS: J5.3  [also labelled JTAGO.TMS]
JTAGO.TDI: J5.7
NetD1_2: D1.2(K) Q1.3(C)
NetQ1_2: Q1.2(E) R7.1
NetR29_2: R29.2 U27.4(2Y)
NetR30_2: R30.2 U27.6(1Y)
NetR122_1: R122.1 U6.2(A2)

### Channels
FPGA01: designators end in A
FPGA02: designators end in B
FPGA03: designators end in C
FPGA30: designators end in D
FPGA31: designators end in E
FPGA32: designators end in F
FPGA33: designators end in G
FPGA10: designators end in H
FPGA11: designators end in I
FPGA12: designators end in J
FPGA13: designators end in K
FPGA20: designators end in L
FPGA21: designators end in M
FPGA22: designators end in N
FPGA23: designators end in O
CFG: designators end in P
FPGA00: designators end in Q

### Buses and harness runs
harness CFG = port CFG = sheet FPGA8B/CFG = sheet FPGAPOWER/CFG
harness CLK = port CLK
harness CLK_R = sheet FPGA1B/CLK_R
harness I2C = port I2C = sheet FPGAPOWER/I2C
harness IL07 = port IL07
harness IL12 = port IL12
harness IL34 = port IL34
harness IL68 = port IL68
harness JTAGI = port JTAGI
harness JTAGO = port JTAGO
harness port MIB = sheet FPGA0B/MIB

### Notes on the sheet
- EXCEPTION #1 !
- BANK 7 DOES NOT HAVE ENOUGH PINS
- SO WE CONNECT 2 PINS TO BANK 0
- BANK 2 DOES NOT HAVE ENOUGH PINS
- SO WE CONNECT 2 PINS TO BANK 1
- EXCEPTION #2 !
- BANK 4 DOES NOT HAVE CLOCK INPUT SO
- WE CONNECT BANK 4 CLOCK TO BANK 3
- EXCEPTION #3 !
- (near F1) 200mA RESETTABLE
- (near U27) BUFFER
- (near J5) JUMPER INSERTED = Enable fpga-to-fpga JTAG daisy-chain
- (near J5) JUMPER REMOVED = Disable fpga-to-fpga JTAG daisy-chain
- (near U6) LEVEL TRANSLATOR
- Red
- PLACE NEXT TO BANK 3
- PLACE NEXT TO BANK 4
- PLACE NEXT TO BANK 6
- PLACE NEXT TO BANK 8
- PLACE NEXT TO BANK 7
- PLACE NEXT TO BANK 0
- PLACE NEXT TO BANK 1
- PLACE NEXT TO BANK 2
- Title
- Engineer
- Revision
- Drawn By
- Checked By
- Date
- Sheet
- of

### Library data of the parts
C6-C8 C16-C18 C20 C21 C23-C25 C27 C29 C30 C32 C34-C36 C38 C47-C49 C51-C53 C55-C57 C59 = CAP: Ceramic Capacitor 100nF ±10% 50V X7R 0402; Manufacturer: Murata; Tr: -55:125; Manufacturer P/N: GCM155R71H104KE02; Tolerance: ±10%; Voltage: 50V; Footprint: *; Package: 0402
C15 C19 C22 C26 C28 C31 C33 C37 C46 C50 C54 C58 = CAP: Ceramic Capacitor 2.2uF ±20% 10V X7R 0603; Manufacturer: TDK; Tr: -55:125; Manufacturer P/N: C1608X7R1A225M080; Tolerance: ±20%; Voltage: 10V; Footprint: *; Package: 0603
D1 = LED0603RD: LED, SMT 0603, Color Red, 5mA, 1.85V; Manufacturer: Panasonic; Manufacturer P/N: LNJ237W82RA; Package: 0603 Polarized
F1 = 0ZCJ0020FF2E: PTC Resettable Fuse, 0.2A, 30V, SMD 1206; Manufacturer: Bell Fuse; Manufacturer P/N: 0ZCJ0020FF2E; Package: 1206
J5 = GRPB052VWVN: Male Header, 0.050" Pitch, 2x5 Position, Right Angle; Manufacturer: Sullins; Manufacturer P/N: GRPB052MWCN
Q1 = MMBT4401-7-F: NPN Small Signal Transistor SMD SOT-23; Manufacturer: Diodes, Inc.; Manufacturer P/N: MMBT4401-7-F
R4 R5 = RES: Thick Film Resistor 4.7k ±1% 0.1W 75V 0402; Manufacturer: Panasonic; Tcr: ±100; Tr: -55:155; Voltage: 75; Power: 0.1; Tolerance: ±1%; Manufacturer P/N: ERJ-2RKF4701X; Alternatives: *; Footprint: *; Package: 0402
R7 = RES: Thick Film Resistor 240 ±1% 0.1W 75V 0402; Manufacturer: Panasonic; Tcr: ±100; Tr: -55:155; Voltage: 75; Power: 0.1; Tolerance: ±1%; Manufacturer P/N: ERJ-2RKF2400X; Alternatives: *; Footprint: *; Package: 0402
R8 R9 = RES: Thick Film Resistor 49.9 ±1% 0.1W 50V 0402; Manufacturer: Panasonic; Tcr: ±100; Tr: -55:155; Voltage: 50; Power: 0.1; Tolerance: ±1%; Manufacturer P/N: ERJ-2RKF49R9X; Alternatives: *; Footprint: *; Package: 0402
R29 R30 R122 = RES: Thick Film Resistor 20 ±1% 0.1W 75V 0402; Manufacturer: Panasonic; Tcr: ±100; Tr: -55:155; Voltage: 75; Power: 0.1; Tolerance: ±1%; Manufacturer P/N: ERJ-2RKF20R0X; Alternatives: *; Footprint: *; Package: 0402
R123 R124 = RES: Thick Film Resistor 1M ±1% 0.1W 75V 0402; Manufacturer: Panasonic; Tcr: ±100; Tr: -55:155; Voltage: 75; Power: 0.1; Tolerance: ±1%; Manufacturer P/N: ERJ-2RKF1004X; Alternatives: *; Footprint: *; Package: 0402
U6 = SN74AVC4T774RSVR: 4-Bit Dual-Supply Bus Transceiver; Manufacturer: Texas Instruments; Manufacturer P/N: SN74AVC4T774RSVR
U27 = SN74LVC2G17DCK: Dual Schmitt-Trigger Buffer; Manufacturer: Texas Instruments; Manufacturer P/N: SN74LVC2G17DCK

## Sheet fpga-bank0.SchDoc: Copper Suicide - FPGA - Bank 0
size Letter; CheckedBy: J. Brinton; CompanyName: Signal Laboratories, Inc.; DrawnBy: J. Brinton; Engineer: J. Brinton; Address1: 3479 Edison Way; Address2: Menlo Park CA 94025; Address3: +1 (877) 778-8435; Address4: siglabs.com; Revision: 3; SheetNumber: 5; SheetTotal: 47
Used 17 times, as channels FPGA01/FPGA0B, FPGA02/FPGA0B, FPGA03/FPGA0B, FPGA30/FPGA0B, FPGA31/FPGA0B, FPGA32/FPGA0B, FPGA33/FPGA0B, FPGA10/FPGA0B, FPGA11/FPGA0B, FPGA12/FPGA0B, FPGA13/FPGA0B, FPGA20/FPGA0B, FPGA21/FPGA0B, FPGA22/FPGA0B, FPGA23/FPGA0B, CFG/FPGA0B, FPGA00/FPGA0B. Parts and nets are listed once, with the designators drawn on the sheet.
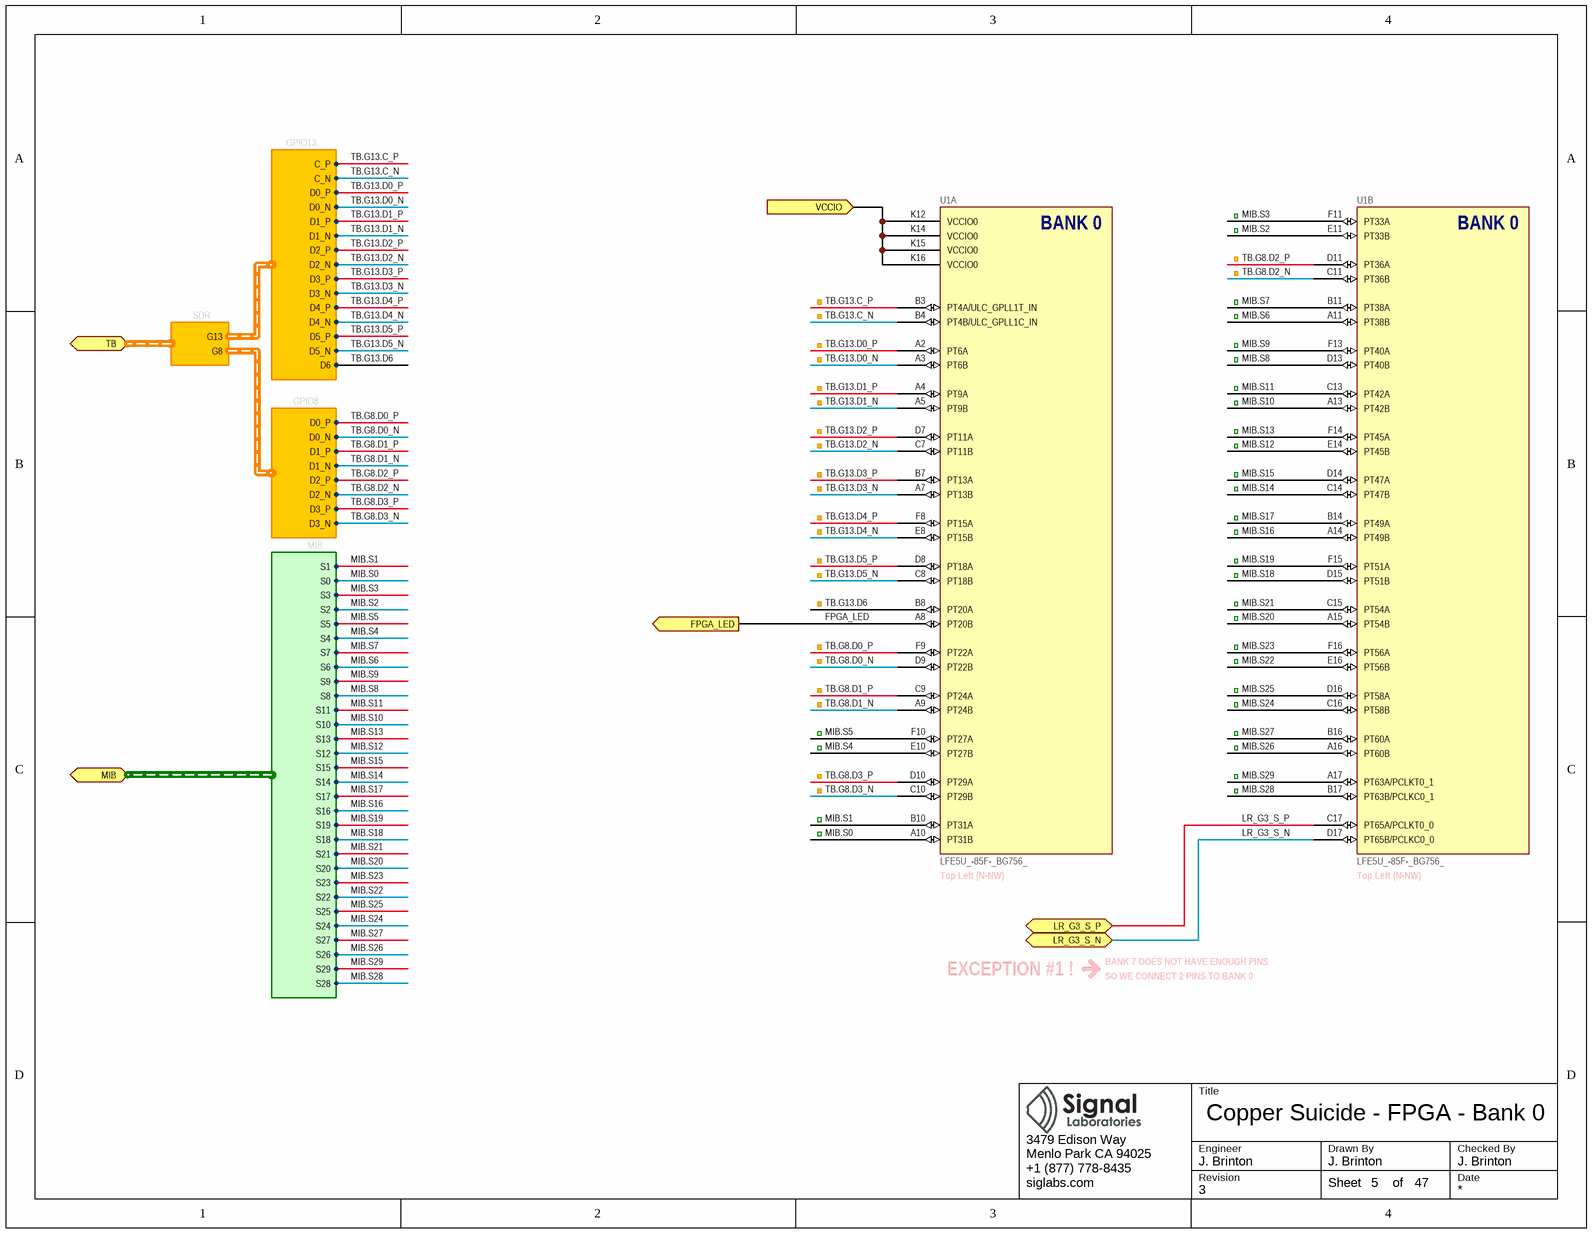
[diagram p2: fpga-bank0.SchDoc]

### Parts
U1  LFE5U_-85F-_BG756_  [caBGA756]  (parts A,B of 19)

### Ports
FPGA_LED (out), LR_G3_S_N, LR_G3_S_P, MIB (harness MIB), TB (harness SDR), VCCIO (in)

### Harnesses
MIB: S1, S0, S3, S2, S5, S4, S7, S6, S9, S8, S11, S10, S13, S12, S15, S14, S17, S16, S19, S18, S21, S20, S23, S22, S25, S24, S27, S26, S29, S28
GPIO8: D0_P, D0_N, D1_P, D1_N, D2_P, D2_N, D3_P, D3_N
SDR: G13, G8
GPIO13: C_P, C_N, D0_P, D0_N, D1_P, D1_N, D2_P, D2_N, D3_P, D3_N, D4_P, D4_N, D5_P, D5_N, D6

### Nets
FPGA_LED: U1.A8(PT20B) ; port FPGA_LED
LR_G3_S_N: U1.D17(PT65B/PCLKC0_0) ; port LR_G3_S_N
LR_G3_S_P: U1.C17(PT65A/PCLKT0_0) ; port LR_G3_S_P
MIB.S0: U1.A10(PT31B) ; port MIB.S0
MIB.S1: U1.B10(PT31A) ; port MIB.S1
MIB.S2: U1.E11(PT33B) ; port MIB.S2
MIB.S3: U1.F11(PT33A) ; port MIB.S3
MIB.S4: U1.E10(PT27B) ; port MIB.S4
MIB.S5: U1.F10(PT27A) ; port MIB.S5
MIB.S6: U1.A11(PT38B) ; port MIB.S6
MIB.S7: U1.B11(PT38A) ; port MIB.S7
MIB.S8: U1.D13(PT40B) ; port MIB.S8
MIB.S9: U1.F13(PT40A) ; port MIB.S9
MIB.S10: U1.A13(PT42B) ; port MIB.S10
MIB.S11: U1.C13(PT42A) ; port MIB.S11
MIB.S12: U1.E14(PT45B) ; port MIB.S12
MIB.S13: U1.F14(PT45A) ; port MIB.S13
MIB.S14: U1.C14(PT47B) ; port MIB.S14
MIB.S15: U1.D14(PT47A) ; port MIB.S15
MIB.S16: U1.A14(PT49B) ; port MIB.S16
MIB.S17: U1.B14(PT49A) ; port MIB.S17
MIB.S18: U1.D15(PT51B) ; port MIB.S18
MIB.S19: U1.F15(PT51A) ; port MIB.S19
MIB.S20: U1.A15(PT54B) ; port MIB.S20
MIB.S21: U1.C15(PT54A) ; port MIB.S21
MIB.S22: U1.E16(PT56B) ; port MIB.S22
MIB.S23: U1.F16(PT56A) ; port MIB.S23
MIB.S24: U1.C16(PT58B) ; port MIB.S24
MIB.S25: U1.D16(PT58A) ; port MIB.S25
MIB.S26: U1.A16(PT60B) ; port MIB.S26
MIB.S27: U1.B16(PT60A) ; port MIB.S27
MIB.S28: U1.B17(PT63B/PCLKC0_1) ; port MIB.S28
MIB.S29: U1.A17(PT63A/PCLKT0_1) ; port MIB.S29
TB.G8.D0_N: U1.D9(PT22B) ; harness GPIO8.D0_N
TB.G8.D0_P: U1.F9(PT22A) ; harness GPIO8.D0_P
TB.G8.D1_N: U1.A9(PT24B) ; harness GPIO8.D1_N
TB.G8.D1_P: U1.C9(PT24A) ; harness GPIO8.D1_P
TB.G8.D2_N: U1.C11(PT36B) ; harness GPIO8.D2_N
TB.G8.D2_P: U1.D11(PT36A) ; harness GPIO8.D2_P
TB.G8.D3_N: U1.C10(PT29B) ; harness GPIO8.D3_N
TB.G8.D3_P: U1.D10(PT29A) ; harness GPIO8.D3_P
TB.G13.C_N: U1.B4(PT4B/ULC_GPLL1C_IN) ; harness GPIO13.C_N
TB.G13.C_P: U1.B3(PT4A/ULC_GPLL1T_IN) ; harness GPIO13.C_P
TB.G13.D0_N: U1.A3(PT6B) ; harness GPIO13.D0_N
TB.G13.D0_P: U1.A2(PT6A) ; harness GPIO13.D0_P
TB.G13.D1_N: U1.A5(PT9B) ; harness GPIO13.D1_N
TB.G13.D1_P: U1.A4(PT9A) ; harness GPIO13.D1_P
TB.G13.D2_N: U1.C7(PT11B) ; harness GPIO13.D2_N
TB.G13.D2_P: U1.D7(PT11A) ; harness GPIO13.D2_P
TB.G13.D3_N: U1.A7(PT13B) ; harness GPIO13.D3_N
TB.G13.D3_P: U1.B7(PT13A) ; harness GPIO13.D3_P
TB.G13.D4_N: U1.E8(PT15B) ; harness GPIO13.D4_N
TB.G13.D4_P: U1.F8(PT15A) ; harness GPIO13.D4_P
TB.G13.D5_N: U1.C8(PT18B) ; harness GPIO13.D5_N
TB.G13.D5_P: U1.D8(PT18A) ; harness GPIO13.D5_P
TB.G13.D6: U1.B8(PT20A) ; harness GPIO13.D6
VCCIO: U1.K12(VCCIO0) U1.K14(VCCIO0) U1.K15(VCCIO0) U1.K16(VCCIO0) ; port VCCIO

### Channels
FPGA01/FPGA0B: designators end in A#1; ports FPGA_LED=FPGA_LED_FPGA01 LR_G3_S_N=IL07.LR.G3.S_N_FPGA01 LR_G3_S_P=IL07.LR.G3.S_P_FPGA01 VCCIO=IL07.VIOTB_FPGA01
FPGA02/FPGA0B: designators end in B#1; ports FPGA_LED=FPGA_LED_FPGA02 LR_G3_S_N=IL07.LR.G3.S_N_FPGA02 LR_G3_S_P=IL07.LR.G3.S_P_FPGA02 VCCIO=IL07.VIOTB_FPGA02
FPGA03/FPGA0B: designators end in C#1; ports FPGA_LED=FPGA_LED_FPGA03 LR_G3_S_N=IL07.LR.G3.S_N_FPGA03 LR_G3_S_P=IL07.LR.G3.S_P_FPGA03 VCCIO=IL07.VIOTB_FPGA03
FPGA30/FPGA0B: designators end in D#1; ports FPGA_LED=FPGA_LED_FPGA30 LR_G3_S_N=IL07.LR.G3.S_N_FPGA30 LR_G3_S_P=IL07.LR.G3.S_P_FPGA30 VCCIO=IL07.VIOTB_FPGA30
FPGA31/FPGA0B: designators end in E#1; ports FPGA_LED=FPGA_LED_FPGA31 LR_G3_S_N=IL07.LR.G3.S_N_FPGA31 LR_G3_S_P=IL07.LR.G3.S_P_FPGA31 VCCIO=IL07.VIOTB_FPGA31
FPGA32/FPGA0B: designators end in F#1; ports FPGA_LED=FPGA_LED_FPGA32 LR_G3_S_N=IL07.LR.G3.S_N_FPGA32 LR_G3_S_P=IL07.LR.G3.S_P_FPGA32 VCCIO=IL07.VIOTB_FPGA32
FPGA33/FPGA0B: designators end in G#1; ports FPGA_LED=FPGA_LED_FPGA33 LR_G3_S_N=IL07.LR.G3.S_N_FPGA33 LR_G3_S_P=IL07.LR.G3.S_P_FPGA33 VCCIO=IL07.VIOTB_FPGA33
FPGA10/FPGA0B: designators end in H#1; ports FPGA_LED=FPGA_LED_FPGA10 LR_G3_S_N=IL07.LR.G3.S_N_FPGA10 LR_G3_S_P=IL07.LR.G3.S_P_FPGA10 VCCIO=IL07.VIOTB_FPGA10
FPGA11/FPGA0B: designators end in I#1; ports FPGA_LED=FPGA_LED_FPGA11 LR_G3_S_N=IL07.LR.G3.S_N_FPGA11 LR_G3_S_P=IL07.LR.G3.S_P_FPGA11 VCCIO=IL07.VIOTB_FPGA11
FPGA12/FPGA0B: designators end in J#1; ports FPGA_LED=FPGA_LED_FPGA12 LR_G3_S_N=IL07.LR.G3.S_N_FPGA12 LR_G3_S_P=IL07.LR.G3.S_P_FPGA12 VCCIO=IL07.VIOTB_FPGA12
FPGA13/FPGA0B: designators end in K#1; ports FPGA_LED=FPGA_LED_FPGA13 LR_G3_S_N=IL07.LR.G3.S_N_FPGA13 LR_G3_S_P=IL07.LR.G3.S_P_FPGA13 VCCIO=IL07.VIOTB_FPGA13
FPGA20/FPGA0B: designators end in L#1; ports FPGA_LED=FPGA_LED_FPGA20 LR_G3_S_N=IL07.LR.G3.S_N_FPGA20 LR_G3_S_P=IL07.LR.G3.S_P_FPGA20 VCCIO=IL07.VIOTB_FPGA20
FPGA21/FPGA0B: designators end in M#1; ports FPGA_LED=FPGA_LED_FPGA21 LR_G3_S_N=IL07.LR.G3.S_N_FPGA21 LR_G3_S_P=IL07.LR.G3.S_P_FPGA21 VCCIO=IL07.VIOTB_FPGA21
FPGA22/FPGA0B: designators end in N#1; ports FPGA_LED=FPGA_LED_FPGA22 LR_G3_S_N=IL07.LR.G3.S_N_FPGA22 LR_G3_S_P=IL07.LR.G3.S_P_FPGA22 VCCIO=IL07.VIOTB_FPGA22
FPGA23/FPGA0B: designators end in O#1; ports FPGA_LED=FPGA_LED_FPGA23 LR_G3_S_N=IL07.LR.G3.S_N_FPGA23 LR_G3_S_P=IL07.LR.G3.S_P_FPGA23 VCCIO=IL07.VIOTB_FPGA23
CFG/FPGA0B: designators end in P#1; ports FPGA_LED=FPGA_LED_CFG LR_G3_S_N=IL07.LR.G3.S_N_CFG LR_G3_S_P=IL07.LR.G3.S_P_CFG VCCIO=IL07.VIOTB_CFG
FPGA00/FPGA0B: designators end in Q#1; ports FPGA_LED=FPGA_LED_FPGA00 LR_G3_S_N=IL07.LR.G3.S_N_FPGA00 LR_G3_S_P=IL07.LR.G3.S_P_FPGA00 VCCIO=IL07.VIOTB_FPGA00

### Notes on the sheet
- (near U1) Top Left (N-NW)
- EXCEPTION #1 !
- BANK 7 DOES NOT HAVE ENOUGH PINS
- SO WE CONNECT 2 PINS TO BANK 0
- Title
- Engineer
- Revision
- Drawn By
- Checked By
- Date
- Sheet
- of
- (in symbol LFE5U_-85F-_BG756_, part A) BANK 0
- (in symbol LFE5U_-85F-_BG756_, part B) BANK 0

### Library data of the parts
U1 = LFE5U_-85F-_BG756_: ECP5 FPGA, 85k LUT, 756-caBGA; Manufacturer: Lattice Semiconductor; Manufacturer P/N: LFE5U_-85F-_BG756_